# EAGLE design motor-board (EAGLE 7.7.0)
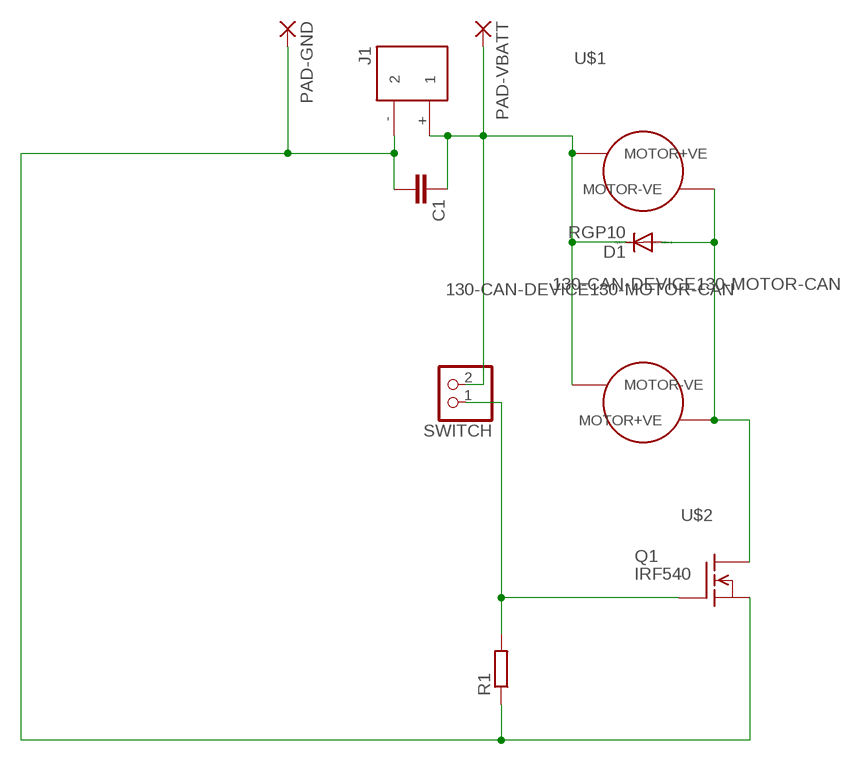
[diagram p0: schematic, sheet 1]

## Parts
C1  C-EU050-024X044  [C050-024X044]
D1  RGP10  [DO41-10]
J1  XT60_FEMALE  [XT60_FEMALE]
PAD-GND  WIREPAD3,81/1,4  [3,81/1,4]
PAD-VBATT  WIREPAD3,81/1,4  [3,81/1,4]
Q1  IRF540  [TO220]
R1  R-EU_0309/10  [0309/10]
SWITCH  PINHD-1X2  [1X02]
U$1  130-CAN-DEVICE130-MOTOR-CAN  [130-MOTOR-CAN]
U$2  130-CAN-DEVICE130-MOTOR-CAN  [130-MOTOR-CAN]

## Nets
GND: C1.2 J1.- PAD-GND.1(P) Q1.3(S) R1.1
MOTOR-VE: D1.A Q1.2(D) U$1.MOTOR-VE U$2.MOTOR+VE
N$5: Q1.1(G) R1.2 SWITCH.1
VBATT: C1.1 D1.C J1.+ PAD-VBATT.1(P) SWITCH.2 U$1.MOTOR+VE U$2.MOTOR-VE

## Library data of the parts
C1 = resistor:C-EU: CAPACITOR, European symbol
D1 = diode:RGP10: DIODE fast-recovery rectifier
J1 = Tristan+Robitaille's+Library:XT60_FEMALE: Vertical Mount Through-Hole Female (receptacle) XT60 Connector
PAD-GND PAD-VBATT = wirepad:WIREPAD: Wire PAD connect wire on PCB
Q1 = transistor-fet:IRF540: N-Channel Enhancement MOSFET (HEXFET); 100V; 28A; 0,077Ohm
R1 = resistor:R-EU_: RESISTOR, European symbol
SWITCH = pinhead:PINHD-1X2: PIN HEADER
U$1 U$2 = 130-can:130-CAN-DEVICE

## Board
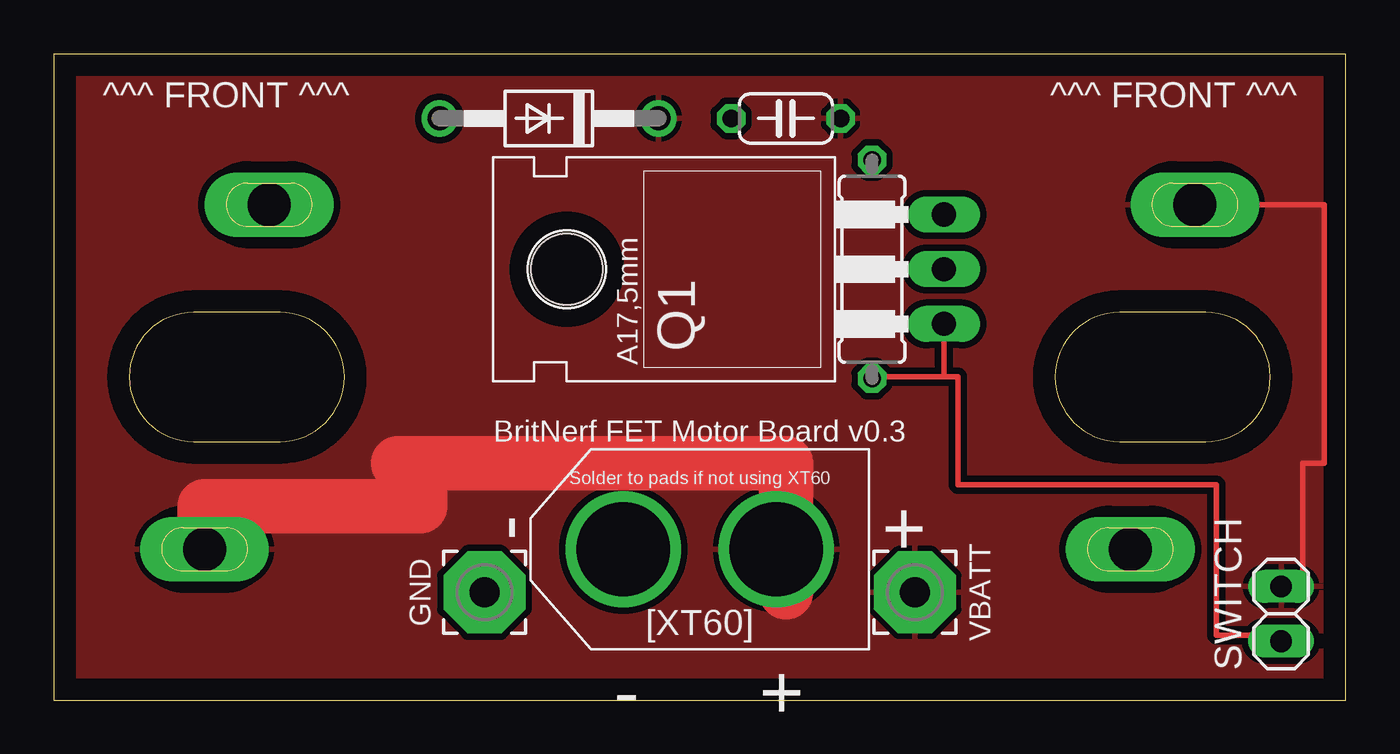
[diagram p1: board, top side]
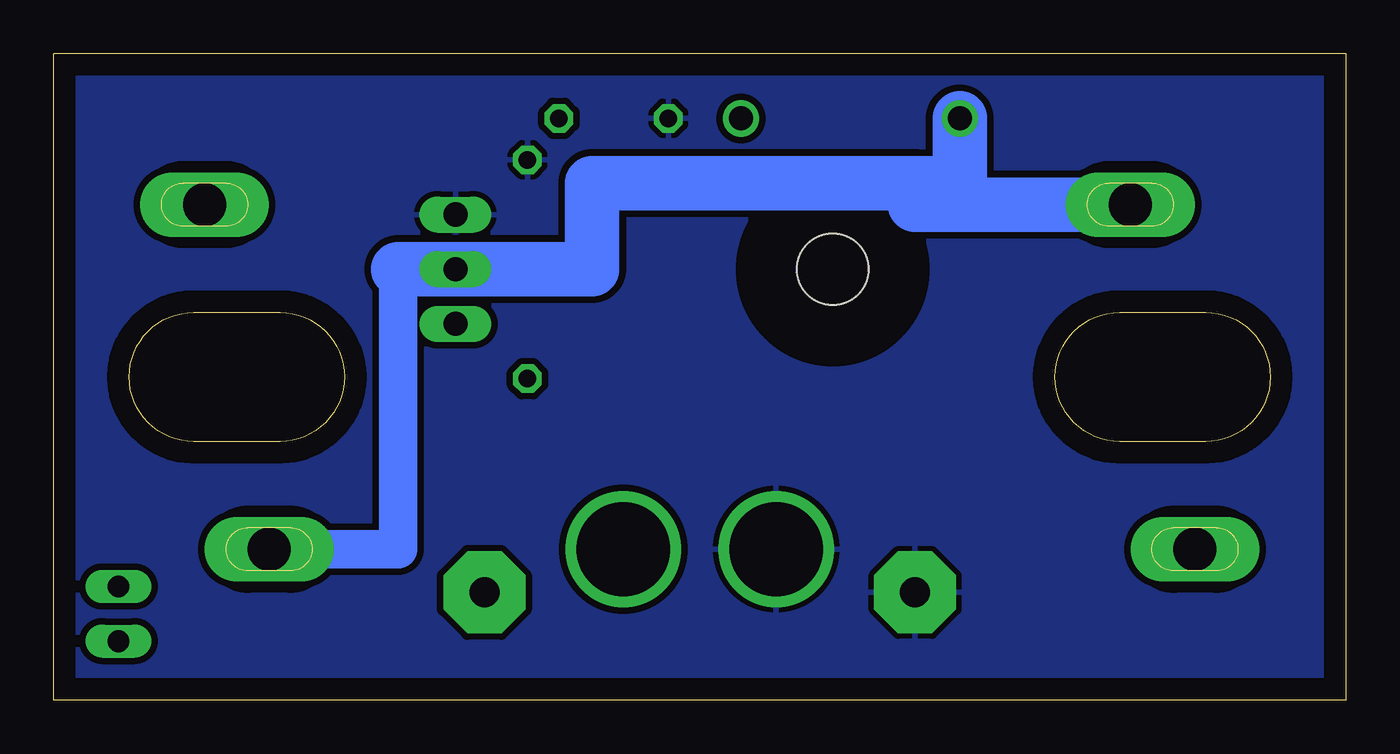
[diagram p2: board, bottom side, seen from below]

Size 60 x 30 mm. Coordinates in mm from the lower left corner, seen from the top.
Outline: 0,0 60,0 60,30 0,30 0,0
Copper layers (1*16): Top 0.035mm / dielectric 1.5mm / Bottom 0.035mm
Design rules "default": minimum track width 10mil, minimum drill 24mil, track to track 8mil, track to pad 8mil, pad to pad 8mil, via to via 8mil, smd to smd 8mil, copper to edge 40mil, drill to drill 8mil, minimum pad ring 10mil, minimum via ring 8mil, stop-mask expansion 4mil, vias tented up to drill 0mil, thermal gap 10mil

### Footprints (pad centres in the part's own frame; a part is rotated, then mirrored left to right if it is on the bottom)
C050-024X044 = drill 0.813 octagon: 1 -2.54,0; 2 2.54,0
DO41-10 = drill 1.118: A 5.08,0; C -5.08,0
XT60_FEMALE = drill 4.35: + 3.55,0; - -3.55,0
3,81/1,4 = drill 1.397 pad 3.81 octagon: 1 0,0
TO220 = drill 1.118 long: 1 -2.54,-6.35; 2 0,-6.35; 3 2.54,-6.35 | hole 3.302: 0,11.176
0309/10 = drill 0.813 octagon: 1 -5.08,0; 2 5.08,0
1X02 = drill 1.016 long: 1 -1.27,0; 2 1.27,0
130-MOTOR-CAN = drill 2 pad 3 long: MOTOR+VE -8,2; MOTOR-VE 8,-1

### Placement (x,y rotation side)
C1  34,27 180 top
D1  23,27 180 top
J1  30,7 0 top
PAD-GND  20,5 0 top
PAD-VBATT  40,5 0 top
Q1  35,20 90 top
R1  38,20 270 top
SWITCH  57,4 90 top
U$1  9,15 90 top
U$2  52,15 90 top

### Tracks (layer width: path | path; a pad name or v marks a point on that pad's centre or on a via)
GND
  pour Bottom (isolate 0.305): 0,30 60,30 60,0 0,0
MOTOR-VE
  Bottom 1.778: 44,20 44,7 U$2.MOTOR+VE 51,7
  Bottom 2.54: U$1.MOTOR-VE 20,23 20,24 | 20,24 35,24 35,20 Q1.2 44,20 | 20,24 17.92,24 D1.A
N$5
  Top 0.254: R1.2 38,15 41.35,15 | 41.35,15 Q1.1 | 41.35,15 42,15 42,10 54,10 54,3 57,3 SWITCH.1
VBATT
  Top 0.254: U$2.MOTOR-VE 59,23 59,11 58,11 58,5 57,5 SWITCH.2
  Top 2.54: J1.+ 34,5 34,11 17,11 | 16,11 17,11 | 17,11 17,9 7,9 U$1.MOTOR+VE
  pour Top (isolate 0.305): 0,30 60,30 60,0 0,0

### Text on the board
tNames: [Flyback Diode] | ^^^ FRONT ^^^ | ^^^ FRONT ^^^ | BritNerf FET Motor Board v0.3 | Solder to pads if not using XT60 | - | + | GND | VBATT | [XT60] | Y:/BoffTac/Logo/monologo-w-address.bmp